# Altium schematic sheet wristband2_ee459.SchDoc
size A
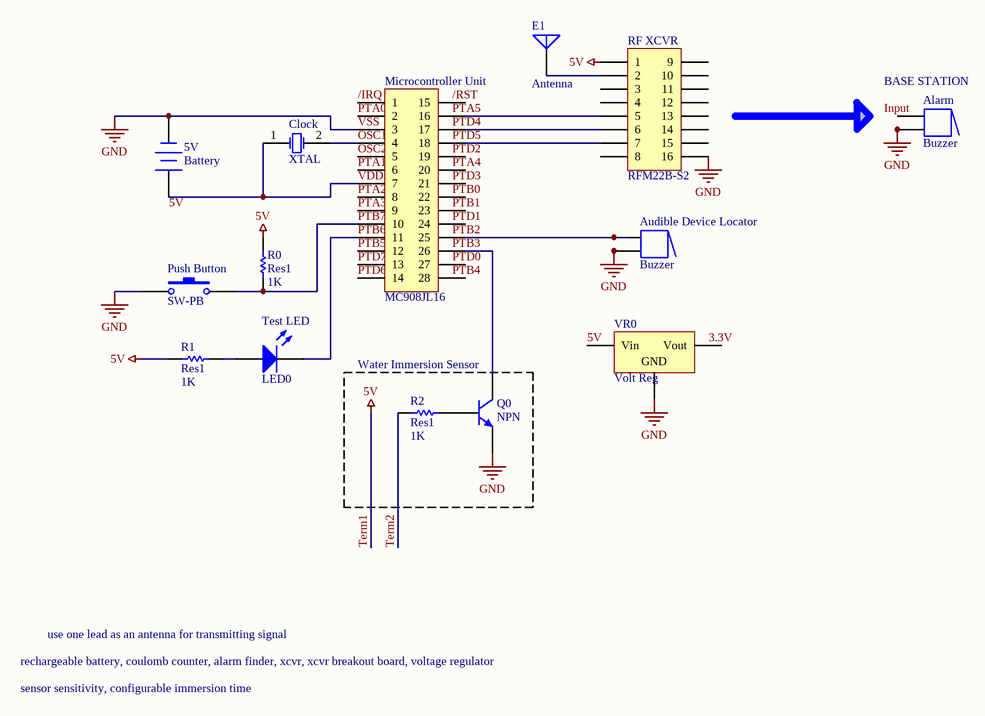
[diagram p0: wristband2_ee459.SchDoc]

## Parts
5V  Battery  [BAT-2]
Alarm  Buzzer  [ABSM-1574]
Audible_Device_Locator  Buzzer  [ABSM-1574]
Clock  XTAL  [R38]
E1  Antenna  [PIN1]
Microcontroller_Unit  MC908JL16  [HDR2X14_CEN]
Push_Button  SW-PB  [SPST-2]
Q0  NPN  [TO-226]
R0  Res1  value 1K  [AXIAL-0.3]
R1  Res1  value 1K  [AXIAL-0.3]
R2  Res1  value 1K  [AXIAL-0.3]
RF_XCVR  RFM22B-S2  [HDR2X8_CEN]
Test_LED  LED0  [LED-0]
VR0  Volt Reg  [D2PAK]

## Blocks framed on the sheet
Water Immersion Sensor: Q0 R2

## Nets
5V: R0.2 R1.2 RF_XCVR.1 VR0.1(Vin)  [also labelled Term1]
VSS: 5V.2(-) Alarm.2 Alarm.2A Audible_Device_Locator.2 Audible_Device_Locator.2A Microcontroller_Unit.3 Push_Button.1 Q0.3(E) RF_XCVR.16 VR0.2(GND)  [also labelled GND]
/IRQ: Microcontroller_Unit.1
OSC1: Clock.2(OSC2) Microcontroller_Unit.4
OSC2: Microcontroller_Unit.5
PTA0: Microcontroller_Unit.2
PTA1: Microcontroller_Unit.6
PTA2: Microcontroller_Unit.8
PTA3: Microcontroller_Unit.9
PTB5: Microcontroller_Unit.12
PTB6: Microcontroller_Unit.11 Test_LED.2(K)
PTB7: Microcontroller_Unit.10 Push_Button.2 R0.1
PTD6: Microcontroller_Unit.14
PTD7: Microcontroller_Unit.13
Term2: R2.1
VDD: 5V.1(+) Clock.1(OSC1) Microcontroller_Unit.7
NetAlarm_1: Alarm.1 Alarm.1A
NetAudible_Device_Locator_1: Audible_Device_Locator.1 Audible_Device_Locator.1A Microcontroller_Unit.25
NetE1_1: E1.1(A) RF_XCVR.2
NetMicrocontroller_Unit_16: Microcontroller_Unit.16 RF_XCVR.5
NetMicrocontroller_Unit_17: Microcontroller_Unit.17 RF_XCVR.6
NetMicrocontroller_Unit_18: Microcontroller_Unit.18 RF_XCVR.7
NetMicrocontroller_Unit_26: Microcontroller_Unit.26 Q0.1(C)
NetQ0_2: Q0.2(B) R2.2
NetR1_1: R1.1 Test_LED.1(A)

Not connected (* = marked no-connect by the designer): Microcontroller_Unit 15 19 20 21 22 23 24 27 28; RF_XCVR 3 4 8 9 10 11 12 13 14 15; VR0 3(Vout)

## Notes on the sheet
- (near Alarm) BASE STATION
- rechargeable battery, coulomb counter, alarm finder, xcvr, xcvr breakout board, voltage regulator
- use one lead as an antenna for transmitting signal
- sensor sensitivity, configurable immersion time
- Labels drawn without touching a wire or pin: 3.3V, 5V, /RST, Input, PTA4, PTA5, PTB0, PTB1, PTB2, PTB3, PTB4, PTD0, PTD1, PTD2, PTD3, PTD4, PTD5

## Library data of the parts
5V = Battery: Multicell Battery; Published: 24-Mar-1999; LatestRevisionDate: 17-Jul-2002; LatestRevisionNote: Re-released for DXP Platform.; PackageReference: BAT-2; Publisher: Altium Limited
Alarm Audible_Device_Locator = Buzzer: Magnetic Transducer Buzzer; Published: 24-Mar-1999; LatestRevisionDate: 17-Dec-2003; LatestRevisionNote: Schematic revised, PCB Footprint replaced.; DatasheetDocument: 17-Dec-2003; PackageReference: ABSM-1574; Publisher: Altium Limited; ComponentLink1Description: Manufacturer Link; ComponentLink1URL: http://www.megastar.com/linecard/buzzmode/index.php
Clock = XTAL: Crystal Oscillator; Published: 8-Jun-2000; LatestRevisionDate: 17-Jul-2002; LatestRevisionNote: Re-released for DXP Platform.; PackageReference: R38; Publisher: Altium Limited
E1 = Antenna: Generic Antenna; Published: 24-Mar-1999; LatestRevisionDate: 17-Jul-2002; LatestRevisionNote: Re-released for DXP Platform.; PackageReference: PIN1; Publisher: Altium Limited
Microcontroller_Unit = Header 14X2A: Header, 14-Pin, Dual row; LatestRevisionDate: 17-Jul-2002; LatestRevisionNote: Re-released for DXP Platform.; Publisher: Altium Limited
Push_Button = SW-PB: Switch; Published: 24-Mar-1999; LatestRevisionDate: 17-Jul-2002; LatestRevisionNote: Re-released for DXP Platform.; PackageReference: SPST-2; Publisher: Altium Limited
Q0 = NPN: NPN Bipolar Transistor; Published: 8-Jun-2000; LatestRevisionDate: 17-Jul-2002; LatestRevisionNote: Re-released for DXP Platform.; PackageReference: TO-226; Publisher: Altium Limited; Code_JEDEC: TO-226-AA
R0-R2 = Res1: Resistor; Published: 8-Jun-2000; LatestRevisionDate: 17-Jul-2002; LatestRevisionNote: Re-released for DXP Platform.; PackageReference: AXIAL-0.3; Publisher: Altium Limited
RF_XCVR = Header 8X2A: Header, 8-Pin, Dual row; LatestRevisionDate: 17-Jul-2002; LatestRevisionNote: Re-released for DXP Platform.; Publisher: Altium Limited
Test_LED = LED0: Typical INFRARED GaAs LED; Published: 8-Jun-2000; LatestRevisionDate: 08-Jul-2005; LatestRevisionNote: Mech Layer 1 removed.; PackageReference: LED-0; Publisher: Altium Limited
VR0 = Volt Reg: Voltage Regulator; Published: 24-Mar-1999; LatestRevisionDate: 17-Jul-2002; LatestRevisionNote: Re-released for DXP Platform.; PackageReference: D2PAK; Publisher: Altium Limited; Code_JEDEC: SMD-220